# Altium schematic sheet 7-GPS.SCHDOC
size A4
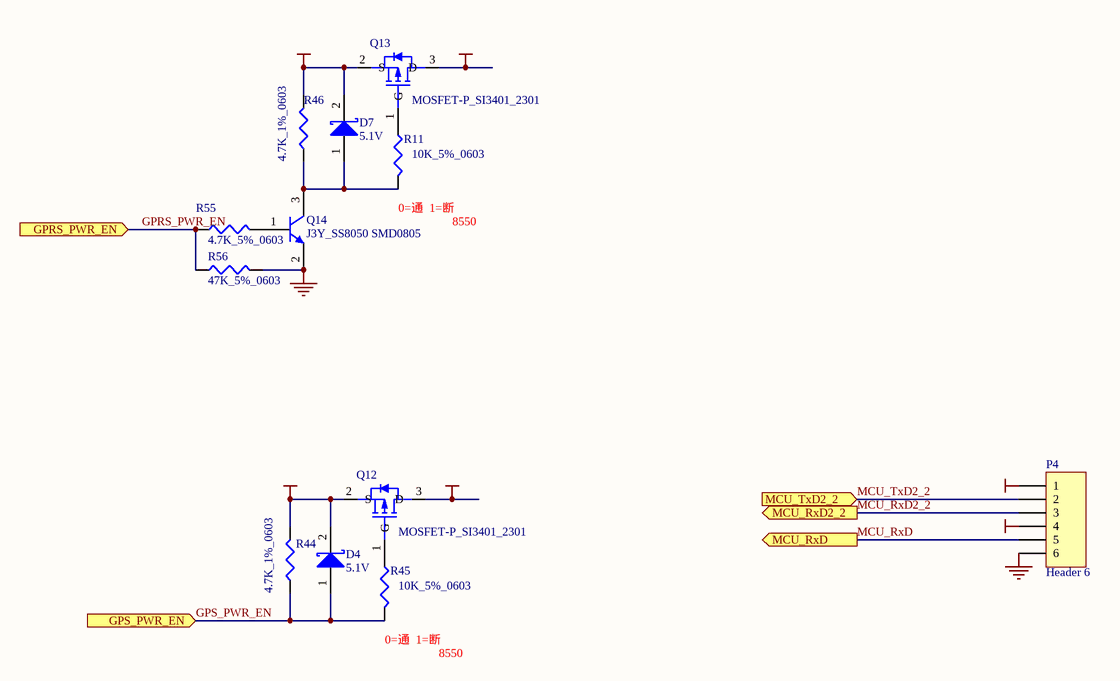
[diagram p0: 7-GPS.SCHDOC]

## Parts
D4  5.1V  [LED0805]
D7  5.1V  [LED0805]
P4  Header 6  [HDR1X6]
Q12  MOSFET-P_SI3401_2301  [SO-G3/C2.5]
Q13  MOSFET-P_SI3401_2301  [SO-G3/C2.5]
Q14  J3Y_SS8050 SMD0805  [SO-G3/C2.5]
R11  10K_5%_0603  [C1608-0603]
R44  4.7K_1%_0603  [C1608-0603]
R45  10K_5%_0603  [C1608-0603]
R46  4.7K_1%_0603  [C1608-0603]
R55  4.7K_5%_0603  [C1608-0603]
R56  47K_5%_0603  [C1608-0603]

## Ports
GPRS_PWR_EN (in), GPS_PWR_EN (in), MCU_RxD2_2 (out), MCU_RxD (out), MCU_TxD2_2 (in)

## Nets
GND: P4.6 Q14.2(E) R56.2(BOT)
V_GPRS: P4.1 Q13.3(D)
V_GPS: P4.4 Q12.3(D)
VCC_2V8: D4.2(K) Q12.2(S) R44.2
VCC_MNG: D7.2(K) Q13.2(S) R46.2
GPRS_PWR_EN: R55.1(TOP) R56.1(TOP) ; port GPRS_PWR_EN
GPS_PWR_EN: D4.1(A) R44.1 R45.2 ; port GPS_PWR_EN
MCU_RxD: P4.5 ; port MCU_RxD
MCU_RxD2_2: P4.3 ; port MCU_RxD2_2
MCU_TxD2_2: P4.2 ; port MCU_TxD2_2
NetD7_1: D7.1(A) Q14.3(C) R11.2 R46.1
NetQ12_1: Q12.1(G) R45.1
NetQ13_1: Q13.1(G) R11.1
NetQ14_1: Q14.1(B) R55.2(BOT)

## Notes on the sheet
- (near R11) 0=通  1=断
- 8550
- (near R45) 0=通  1=断

## Library data of the parts
D4 D7 = D Schottky: Schottky Diode; Code - JEDEC: DO-214-AA; Published: 8-Jun-2000; Revision: July-2002: Re-released for DXP Platform.; Publisher: Altium Limited
P4 = Header 6: Header, 6-Pin; LatestRevisionDate: 17-Jul-2002; LatestRevisionNote: Re-released for DXP Platform.; Publisher: Altium Limited
Q12 Q13 = MOSFET-P
Q14 = QNPN: NPN Bipolar Transistor; Code - JEDEC: SOT-23; Published: 8-Jun-2000; Revision: July-2002: Re-released for DXP Platform.; Publisher: Altium Limited
R11 R44-R46 = Res3: Resistor; Value: 1K%5 0603; Published: 8-Jun-2000; Revision: July-2002: Re-released for DXP Platform.; Publisher: Altium Limited
R55 R56 = RES: Resistor; Value: 1k 5% 0603